# EAGLE design OledBoardV3 (EAGLE 9.5.0)
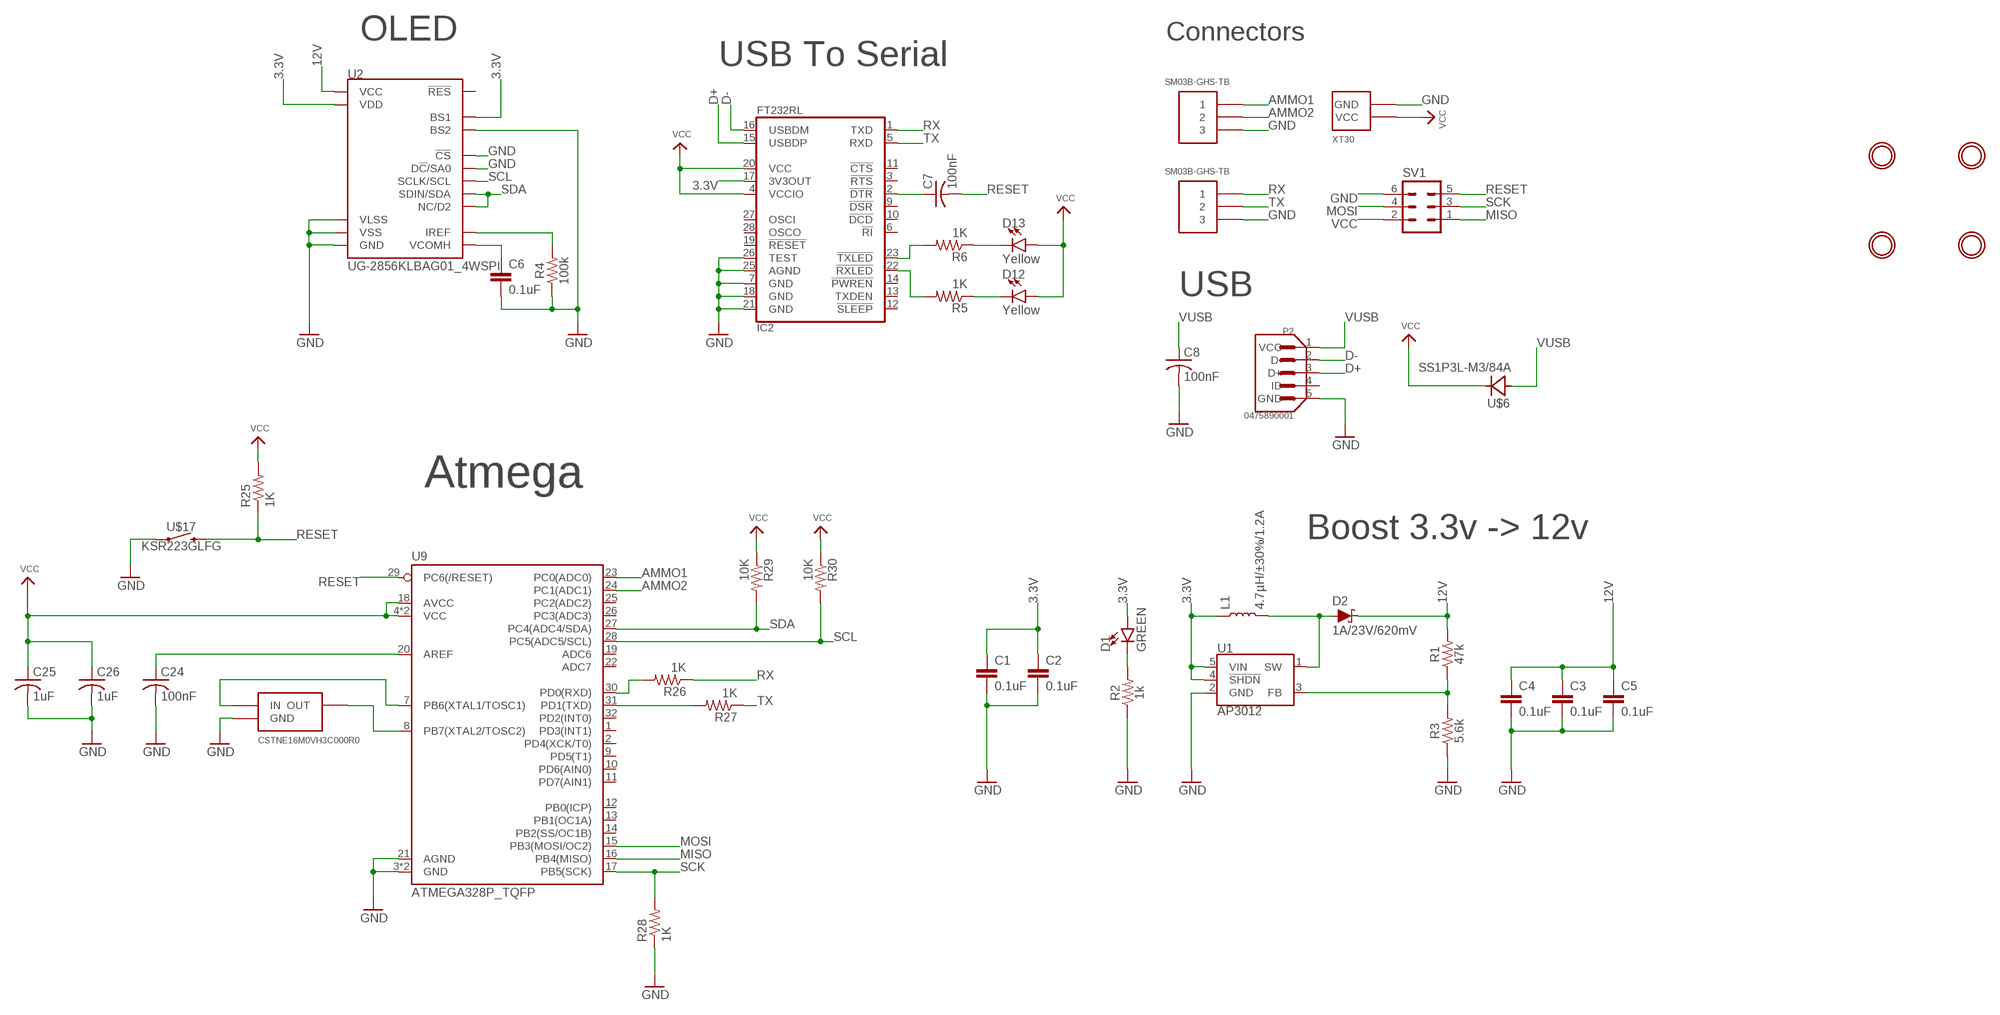
[diagram p0: schematic, sheet 1]

## Parts
C1  0.1uF  0.1UF-0603-25V-(+80/-20%)  [0603]
C2  0.1uF  0.1UF-0603-25V-(+80/-20%)  [0603]
C3  0.1uF  0.1UF-0603-25V-(+80/-20%)  [0603]
C4  0.1uF  0.1UF-0603-25V-(+80/-20%)  [0603]
C5  0.1uF  0.1UF-0603-25V-(+80/-20%)  [0603]
C6  0.1uF  0.1UF-0603-25V-(+80/-20%)  [0603]
C7  100nF  C-USC0603  [C0603]
C8  100nF  C-USC0603  [C0603]
C24  100nF  C-USC0603  [C0603]
C25  1uF  C-USC0603  [C0603]
C26  1uF  C-USC0603  [C0603]
D1  GREEN  LED0603  [LED-0603]
D2  1A/23V/620mV  DIODE-SCHOTTKY-BAT20J  [SOD-323]
D12  Yellow  LED0603  [LED-0603]
D13  Yellow  LED0603  [LED-0603]
IC2  FT232RL  [SSOP28-LD]
L1  4.7µH/±30%/1.2A  INDUCTOR-CDRH-4.7UH  [INDUCTOR_4.7UH]
P2  0475890001  [MOLEX_0475890001]
R1  47k  47KOHM-0603-1/10W-1%  [0603]
R2  1k  1KOHM-0603-1/10W-1%  [0603]
R3  5.6k  5.6KOHM-0603-1/10W-1%  [0603]
R4  100k  100KOHM-0603-1/10W-1%  [0603]
R5  1K  R-US_R0603  [R0603]
R6  1K  R-US_R0603  [R0603]
R25  1K  R-US_R0603  [R0603]
R26  1K  R-US_R0603  [R0603]
R27  1K  R-US_R0603  [R0603]
R28  1K  R-US_R0603  [R0603]
R29  10K  R-US_R0603  [R0603]
R30  10K  R-US_R0603  [R0603]
SV1  MA03-2  [MA03-2]
U1  AP3012  [SOT23-5]
U2  UG-2856KLBAG01_4WSPI  [FPC05024-42201]
U9  ATMEGA328P_TQFP  [TQFP32-08]
U$1  MOUNTINGHOLE2.5  [MOUNTINGHOLE_2.5_PLATED]
U$2  MOUNTINGHOLE2.5  [MOUNTINGHOLE_2.5_PLATED]
U$3  MOUNTINGHOLE2.5  [MOUNTINGHOLE_2.5_PLATED]
U$4  MOUNTINGHOLE2.5  [MOUNTINGHOLE_2.5_PLATED]
U$5  SM03B-GHS-TB  [SM03B-GHS-TB]
U$6  SS1P3L-M3/84A  [SS1P3L-M3/84A]
U$8  SM03B-GHS-TB  [SM03B-GHS-TB]
U$9  XT30PW-M  [XT30]
U$16  CSTNE16M0VH3C000R0  [CSTNE16M0VH3C000R0]
U$17  KSR223GLFG  [KSR223GLFG]

## Nets
3.3V: C1.1 C2.1 D1.A IC2.17(3V3OUT) L1.P$1 U1.4(!SHDN!) U1.5(VIN) U2.P$5(VDD) U2.P$6(BS1)
12V: C3.1 C4.1 C5.1 D2.C R1.2 U2.P$23(VCC)
AMMO1: U9.23(PC0(ADC0)) U$5.P$3
AMMO2: U9.24(PC1(ADC1)) U$5.P$4
D+: IC2.15(USBDP) P2.3(D+)
D-: IC2.16(USBDM) P2.2(D-)
GND: C1.2 C2.2 C3.2 C4.2 C5.2 C6.2 C8.2 C24.2 C25.2 C26.2 IC2.7(GND) IC2.18(GND) IC2.21(GND) IC2.25(AGND) IC2.26(TEST) P2.5(GND) R2.1 R3.1 R4.1 R28.1 SV1.6 U1.2(GND) U2.P$1(GND) U2.P$2(VLSS) U2.P$3(VSS) U2.P$7(BS2) U2.P$8(!CS) U2.P$10(D!C!/SA0) U2.P$11(GND) U2.P$12(GND) U2.P$16(GND) U2.P$17(GND) U2.P$18(GND) U2.P$19(GND) U2.P$20(GND) U2.P$24(GND) U9.3(GND) U9.5(GND) U9.21(AGND) U$5.P$5 U$8.P$5 U$9.P$2(GND) U$16.2(GND) U$17.P$1
MISO: SV1.1 U9.16(PB4(MISO))
MOSI: SV1.4 U9.15(PB3(MOSI/OC2))
N$1: D1.C R2.2
N$2: R1.1 R3.2 U1.3(FB)
N$3: C6.1 U2.P$22(VCOMH)
N$4: D2.A L1.P$2 U1.1(SW)
N$5: R4.2 U2.P$21(IREF)
N$6: C7.1 IC2.2(!DTR)
N$7: IC2.23(!TXLED) R6.2
N$8: IC2.22(!RXLED) R5.2
N$9: D13.C R6.1
N$10: D12.C R5.1
N$35: U9.7(PB6(XTAL1/TOSC1)) U$16.1(IN)
N$36: U9.8(PB7(XTAL2/TOSC2)) U$16.3(OUT)
N$37: C24.1 U9.20(AREF)
N$38: R27.2 U9.31(PD1(TXD))
N$40: R26.2 U9.30(PD0(RXD))
RESET: C7.2 R25.1 SV1.5 U9.29(PC6(/RESET)) U$17.P$2
RX: IC2.1(TXD) R26.1 U$8.P$3
SCK: R28.2 SV1.3 U9.17(PB5(SCK))
SCL: R30.2 U2.P$13(SCLK/SCL) U9.28(PC5(ADC5/SCL))
SDA: R29.2 U2.P$14(SDIN/SDA) U2.P$15(NC/D2) U9.27(PC4(ADC4/SDA))
TX: IC2.5(RXD) R27.1 U$8.P$4
VCC: C25.1 C26.1 D12.A D13.A IC2.4(VCCIO) IC2.20(VCC) R25.2 R29.1 R30.1 SV1.2 U9.4(VCC) U9.6(VCC) U9.18(AVCC) U$6.P$1(C) U$9.P$1(VCC)
VUSB: C8.1 P2.1(VCC) U$6.P$2(A)
Unconnected: IC2.3(!RTS) IC2.6(!RI) IC2.9(!DSR) IC2.10(!DCD) IC2.11(!CTS) IC2.12(!SLEEP) IC2.13(TXDEN) IC2.14(!PWREN) IC2.19(!RESET) IC2.27(OSCI) IC2.28(OSCO) P2.4(ID) U2.P$9(!RES) U9.1(PD3(INT1)) U9.2(PD4(XCK/T0)) U9.9(PD5(T1)) U9.10(PD6(AIN0)) U9.11(PD7(AIN1)) U9.12(PB0(ICP)) U9.13(PB1(OC1A)) U9.14(PB2(SS/OC1B)) U9.19(ADC6) U9.22(ADC7) U9.25(PC2(ADC2)) U9.26(PC3(ADC3)) U9.32(PD2(INT0))

## Notes on the sheet
- OLED | Connectors
- USB To Serial
- USB
- Atmega
- Boost 3.3v -> 12v

## Library data of the parts
C1-C6 = SparkFun-Capacitors:0.1UF: 0.1µF ceramic capacitors A capacitor is a passive two-terminal electrical component used to store electrical energy temporarily in an electric field.; PROD_ID: CAP-00810
C7 C8 C24-C26 = rcl:C-US: CAPACITOR, American symbol; SPICEPREFIX: C
D1 D12 D13 = SparkFun-LED:LED: LED (Generic) Standard schematic elements and footprints for 5mm, 3mm, 1206, and 0603 sized LEDs. Generic LEDs with no color specified.
D2 = SparkFun-DiscreteSemi:DIODE-SCHOTTKY: Schottky diode A Schottky diode is a semiconductor diode which has a low forward voltage drop and a very fast switching action.; PROD_ID: DIO-11623
IC2 = FT232RL:FT232RL; DESCRIPTION: USB Bridge, USB to UART USB 2.0 UART Interface 28-SSOP; DIGI-KEY_PART_NUMBER: 768-1007-1-ND; DIGI-KEY_PURCHASE_URL: https://www.digikey.com/product-detail/en/ftdi-future-technology-devices-international-ltd/FT232RL-REEL/768-1007-1-ND/1836402?utm_source=snapeda&utm_medium=aggregator&utm_campaign=symbol; MF: FTDI, Future; MP: FT232RL; PACKAGE: SSOP-28 FTDI, Future
L1 = SparkFun-Coils:INDUCTOR: Inductors Resist changes in electrical current. Basically a coil of wire. SparkFun Products: SparkFun Load Cell Amplifier - HX711 <https://www.sparkfun.com/products/13879> IOIO-OTG - V2.2 <https://www.sparkfun.com/products/13613>; PROD_ID: NDUC-10146
P2 = 0475890001:0475890001: Conn Micro USB Type AB RCP 5 POS 0.65mm Solder RA SMD 5 Terminal 1 Port T/R; DESCRIPTION: USB - micro AB Receptacle Connector 5 Position Surface Mount, Right Angle; Through Hole; DIGI-KEY_PART_NUMBER: WM17143CT-ND; DIGI-KEY_PURCHASE_URL: https://www.digikey.com/product-detail/en/molex/0475890001/WM17143CT-ND/1832255?utm_source=snapeda&utm_medium=aggregator&utm_campaign=symbol; MF: Molex; MP: 0475890001; PACKAGE: None
R1 = SparkFun-Resistors:47KOHM: 47kΩ resistor A resistor is a passive two-terminal electrical component that implements electrical resistance as a circuit element. Resistors act to reduce current flow, and, at the same time, act to lower voltage levels within circuits. - Wikipedia; PROD_ID: RES-07871
R2 = SparkFun-Resistors:1KOHM: 1kΩ resistor A resistor is a passive two-terminal electrical component that implements electrical resistance as a circuit element. Resistors act to reduce current flow, and, at the same time, act to lower voltage levels within circuits. - Wikipedia; PROD_ID: RES-07856
R3 = SparkFun-Resistors:5.6KOHM: 5.6kΩ resistor A resistor is a passive two-terminal electrical component that implements electrical resistance as a circuit element. Resistors act to reduce current flow, and, at the same time, act to lower voltage levels within circuits. - Wikipedia; PROD_ID: RES-12378
R4 = SparkFun-Resistors:100KOHM: 100kΩ resistor A resistor is a passive two-terminal electrical component that implements electrical resistance as a circuit element. Resistors act to reduce current flow, and, at the same time, act to lower voltage levels within circuits. - Wikipedia; PROD_ID: RES-07828
R5 R6 R25-R30 = rcl:R-US_: RESISTOR, American symbol; SPICEPREFIX: R
SV1 = con-lstb:MA03-2: PIN HEADER; OC_FARNELL: unknown; OC_NEWARK: unknown
U1 = SparkFun-IC-Power:AP3012: AP3012 The AP3012 is a high power, constant frequency, current mode PWM, inductor based, step-up (boost) converter. The converter operates at high frequency (1.5MHz) so that a small, low profile inductor can be used. Datasheet <https://www.diodes.com/assets/Datasheets/AP3012.pdf>; PROD_ID: VREG-13911
U2 = SparkFun-Displays:UG-2856KLBAG01_4WSPI; PROD_ID: CONN-14195
U9 = SparkFun-IC-Microcontroller:ATMEGA328P_TQFP: Popular 328P in QFP Storefront component: ATmega328 - TQFP <https://www.sparkfun.com/products/13448> (COM-13448) Datasheet <http://www.sparkfun.com/datasheets/Components/SMD/ATMega328.pdf> SparkFun Products SparkFun RedBoard - Programmed with Arduino <https://www.sparkfun.com/products/12757> (DEV-12757) Arduino Pro Mini 328 - 5V/16MHz <https://www.sparkfun.com/products/11113> (DEV-11113) Arduino Pro Mini 328 - 3.3V/8MHz <https://www.sparkfun.com/products/11114> (DEV-11114) SparkFun OpenLog <https://www.sparkfun.com/products/13712> (DEV-13712) SparkFun MicroView - OLED Arduino Module <https://www.sparkfun.com/products/12923> (DEV-12923) SparkFun Digital Sandbox <https://www.sparkfun.com/products/12651> (DEV-12651) SparkFun PicoBoard <https://www.sparkfun.com/products/11888> (WIG-11888) Arduino Fio <https://www.sparkfun.com/products/10116> (DEV-10116) LilyPad Arduino 328 Main Board <https://www.sparkfun.com/products/13342> (DEV-13342) SparkFun RedStick <https://www.sparkfun.com/products/13741> (DEV-13741) LilyPad MP3 <https://www.sparkfun.com/products/11013> (DEV-11013) LilyPad Arduino SimpleSnap <https://www.sparkfun.com/products/10941> (DEV-10941) SparkFun Stepoko <https://www.sparkfun.com/products/13899> (ROB-13899) SparkFun Geiger Counter <https://www.sparkfun.com/products/11345> (SEN-11345) SparkFun EL Sequencer <https://www.sparkfun.com/products/12781> (COM-12781) Arduino Pro 328 - 5V/16MHz <https://www.sparkfun.com/products/10915> (DEV-10915) CryptoCape <https://www.sparkfun.com/products/12773> (DEV-12773) SparkFun IR Thermometer Evaluation Board - MLX90614 <https://www.sparkfun.com/products/10740> (SEN-10740) SparkFun RedBot Mainboard <https://www.sparkfun.com/products/12097> (ROB-12097) Arduino Pro 328 - 3.3V/8MHz <https://www.sparkfun.com/products/10914> (DEV-10914) SparkFun Block for Intel® Edison - Arduino <https://www.sparkfun.com/products/13036> (DEV-13036) SparkFun Simon Says - Surface Mount Soldering Kit <https://www.sparkfun.com/products/10935> (KIT-10935) SparkFun 7-Segment Serial Display - Red <https://www.sparkfun.com/products/11441> (COM-11441) SparkFun 7-Segment Serial Display - White <https://www.sparkfun.com/products/11629> (COM-11629) SparkFun 7-Segment Serial Display - Yellow <https://www.sparkfun.com/products/11443> (COM-11443) SparkFun 7-Segment Serial Display - Kelly Green <https://www.sparkfun.com/products/11440> (COM-11440) SparkFun 7-Segment Serial Display - Blue <https://www.sparkfun.com/products/11442> (COM-11442) SparkFun OpenSegment Serial Display - 20mm (Blue) <https://www.sparkfun.com/products/11647> (COM-11647) SparkFun OpenSegment Serial Display - 20mm (Green) <https://www.sparkfun.com/products/11646> (COM-11646) SparkFun OpenSegment Serial Display - 20mm (White) <https://www.sparkfun.com/products/11648> (COM-11648) SparkFun OpenSegment Serial Display - 20mm (Red) <https://www.sparkfun.com/products/11644> (COM-11644) SparkFun OpenSegment Serial Display - 20mm (Yellow) <https://www.sparkfun.com/products/11645> (COM-11645) SparkFun OpenSegment Shield <https://www.sparkfun.com/products/13190> (DEV-13190); PROD_ID: IC-09069
U$1-U$4 = microbuilder:MOUNTINGHOLE: Mounting Hole For #2 screws (0.086"/2.18mm width, 0.094"/2.4mm hole) use 2.5mm
U$5 U$8 = oledBoard:SM03B-GHS-TB
U$6 = HenrySilva:SS1P3L-M3/84A
U$9 = oledBoard:XT30PW-M
U$16 = HenrySilva:CSTNE16M0VH3C000R0
U$17 = HenrySilva:KSR223GLFG

## Net classes
2 Power: width 0.203 mm, drill 0.203 mm, clearance 0.203 mm

## Board
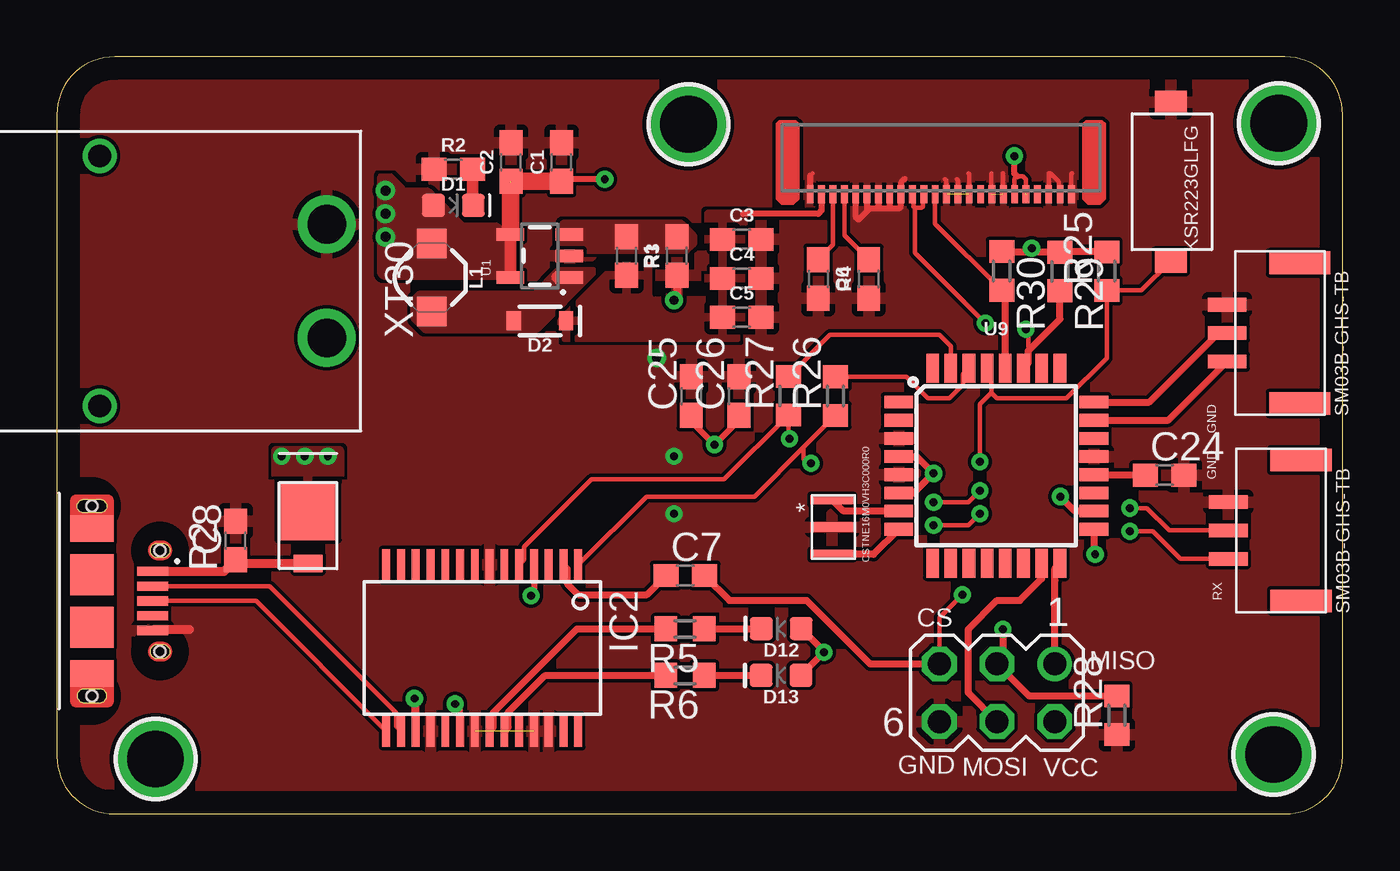
[diagram p1: board, top side]
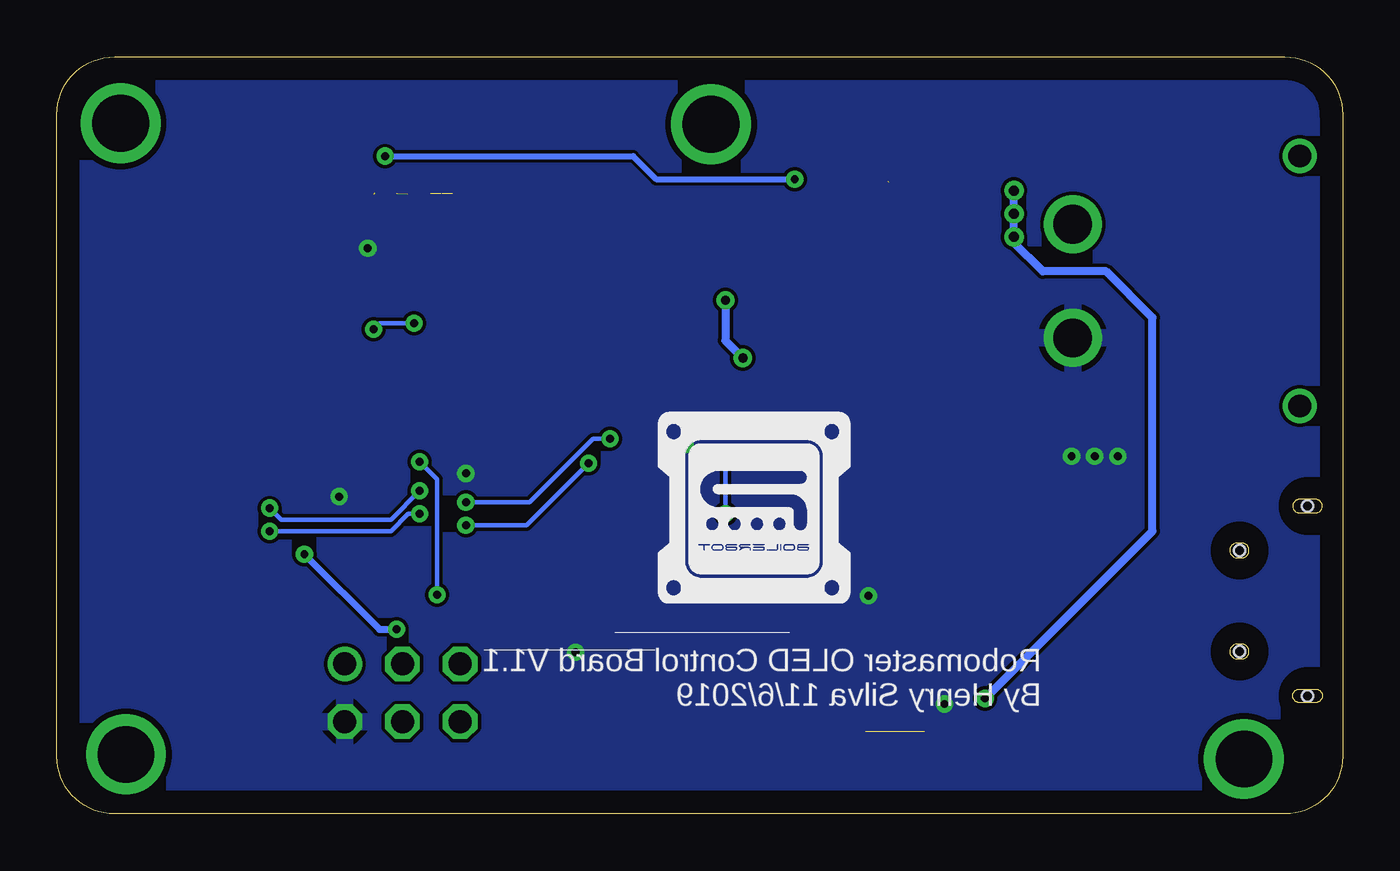
[diagram p2: board, bottom side, seen from below]

Size 56.62 x 33.33 mm. Coordinates in mm from the lower left corner, seen from the top.
Outline: 54.08,33.33 2.54,33.33 arc90 0,30.79 0,2.54 arc90 2.54,0 54.08,0 arc90 56.62,2.54 56.62,30.79 arc90 54.08,33.33
Copper layers (1*16): Top 0.035mm / dielectric 1.5mm / Bottom 0.035mm
Design rules "default *": minimum track width 6mil, minimum drill 0.35mm, track to track 6mil, track to pad 6mil, pad to pad 6mil, via to via 6mil, smd to smd 6mil, copper to edge 40mil, drill to drill 6mil, minimum pad ring 10mil, minimum via ring 8mil, stop-mask expansion 4mil, vias tented up to drill 23mil, thermal gap 10mil

### Footprints (pad centres in the part's own frame; a part is rotated, then mirrored left to right if it is on the bottom)
0603 = smd 1.1 x 1: 1 -0.85,0; 2 0.85,0
C0603 = smd 1.1 x 1: 1 -0.85,0; 2 0.85,0
LED-0603 = smd 1 x 1: A -0.877,0; C 0.877,0
SOD-323 = smd 0.63 x 0.83: A 1.15,0; C -1.15,0
SSOP28-LD = smd 0.348 x 1.397: 1 -4.225,-3.656; 2 -3.575,-3.656; 3 -2.925,-3.656; 4 -2.275,-3.656; 5 -1.625,-3.656; 6 -0.975,-3.656; 7 -0.325,-3.656; 8 0.325,-3.656; 9 0.975,-3.656; 10 1.625,-3.656; 11 2.275,-3.656; 12 2.925,-3.656; 13 3.575,-3.656; 14 4.225,-3.656; 15 4.225,3.656; 16 3.575,3.656; 17 2.925,3.656; 18 2.275,3.656; 19 1.625,3.656; 20 0.975,3.656; 21 0.325,3.656; 22 -0.325,3.656; 23 -0.975,3.656; 24 -1.625,3.656; 25 -2.275,3.656; 26 -2.925,3.656; 27 -3.575,3.656; 28 -4.225,3.656
INDUCTOR_4.7UH = smd 1.3 x 1.3: P$1 -1.5,0; P$2 1.5,0
MOLEX_0475890001 = smd 0.4 x 1.35: 1 -1.3,2.675; 2 -0.65,2.675; 3 0,2.675; 4 0.65,2.675; 5 1.3,2.675 | smd 1.175 x 1.9: 6 -3.187,0; 9 3.187,0 | smd 1.8 x 1.9: 7 -1.15,0; 8 1.15,0 | hole 0.5: -2.225,3; 2.225,3; -4.175,0; 4.175,0
R0603 = smd 1 x 1.1: 1 -0.85,0; 2 0.85,0
MA03-2 = drill 1.016: 1 -2.54,-1.27 | drill 1.016 octagon: 2 -2.54,1.27; 3 0,-1.27; 4 0,1.27; 5 2.54,-1.27; 6 2.54,1.27
SOT23-5 = smd 0.55 x 1.2: 1 -0.95,-1.3; 2 0,-1.3; 3 0.95,-1.3; 4 0.95,1.3; 5 -0.95,1.3
FPC05024-42201 = smd 0.3 x 0.8: P$1 -5.75,0.4; P$2 -5.25,0.4; P$3 -4.75,0.4; P$4 -4.25,0.4; P$5 -3.75,0.4; P$6 -3.25,0.4; P$7 -2.75,0.4; P$8 -2.25,0.4; P$9 -1.75,0.4; P$10 -1.25,0.4; P$11 -0.75,0.4; P$12 -0.25,0.4; P$13 0.25,0.4; P$14 0.75,0.4; P$15 1.25,0.4; P$16 1.75,0.4; P$17 2.25,0.4; P$18 2.75,0.4; P$19 3.25,0.4; P$20 3.75,0.4; P$21 4.25,0.4; P$22 4.75,0.4; P$23 5.25,0.4; P$24 5.75,0.4
TQFP32-08 = smd 1.27 x 0.559: 1 -4.293,2.8; 2 -4.293,2; 3 -4.293,1.2; 4 -4.293,0.4; 5 -4.293,-0.4; 6 -4.293,-1.2; 7 -4.293,-2; 8 -4.293,-2.8; 17 4.293,-2.8; 18 4.293,-2; 19 4.293,-1.2; 20 4.293,-0.4; 21 4.293,0.4; 22 4.293,1.2; 23 4.293,2; 24 4.293,2.8 | smd 0.559 x 1.27: 9 -2.8,-4.293; 10 -2,-4.293; 11 -1.2,-4.293; 12 -0.4,-4.293; 13 0.4,-4.293; 14 1.2,-4.293; 15 2,-4.293; 16 2.8,-4.293; 25 2.8,4.293; 26 2,4.293; 27 1.2,4.293; 28 0.4,4.293; 29 -0.4,4.293; 30 -1.2,4.293; 31 -2,4.293; 32 -2.8,4.293
MOUNTINGHOLE_2.5_PLATED = drill 2.5 pad 3.2: P$1 0,0
SM03B-GHS-TB = smd 1 x 2.7: P$1 0.5,1.35; P$2 6.7,1.35 | smd 0.6 x 1.7: P$3 2.35,4.55; P$4 3.6,4.55; P$5 4.85,4.55
SS1P3L-M3/84A = smd 2.54 x 2.667: P$1 1.27,1.27 | smd 0.762 x 1.27: P$2 3.574,1.275
XT30 = drill 1.7: P$1 0,0; P$2 5,0 | drill 1: P$3 -3,10; P$4 8,10
CSTNE16M0VH3C000R0 = smd 0.4 x 1.9: 1 2.6,1; 2 1.4,1; 3 0.2,1
KSR223GLFG = smd 1 x 1.4: P$1 0.5,0.7; P$2 7.5,0.7

### Placement (x,y rotation side)
C1  22.23,28.69 90 top
C2  20,28.69 90 top
C3  30.16,25.29 0 top
C4  30.16,23.57 0 top
C5  30.16,21.86 0 top
C6  33.53,23.55 270 top
C7  27.67,10.49 0 top
C8  7.87,12.03 90 top
C24  48.78,14.91 0 top
C25  27.94,18.39 90 top
C26  30.04,18.39 90 top
D1  17.46,26.78 0 top
D2  21.27,21.7 180 top
D12  31.9,8.15 180 top
D13  31.89,6.1 180 top
IC2  18.73,7.3 180 top
L1  16.51,23.61 270 top
P2  1.55,9.37 270 top
R1  25.08,24.56 270 top
R2  17.46,28.37 0 top
R3  27.3,24.56 90 top
R4  35.75,23.55 90 top
R5  27.66,8.14 180 top
R6  27.66,6.1 180 top
R25  46.23,23.89 90 top
R26  34.29,18.39 90 top
R27  32.21,18.4 90 top
R28  46.67,4.34 90 top
R29  44.17,23.88 270 top
R30  41.61,23.9 270 top
SV1  41.4,5.33 180 top
U1  21.27,24.56 90 top
U2  38.93,27.67 180 top
U9  41.36,15.33 0 top
U$1  27.81,30.35 0 top
U$2  4.35,2.42 0 top
U$3  53.58,2.62 0 top
U$4  53.81,30.4 0 top
U$5  56.08,17.56 90 top
U$6  9.79,14.59 270 top
U$8  56.13,8.88 90 top
U$9  11.89,20.95 90 top
U$16  35.14,11.23 90 top
U$17  48.35,31.83 270 top

### Tracks (layer width: path | path; a pad name or v marks a point on that pad's centre or on a via)
3.3V  (via drill 0.35, 0.45)  (2 unrouted)
  Top 0.203: 42.63,27.32 42.67,27.37 42.67,27.94 42.55,28.07 42.29,28.07 42.17,27.95 U2.P$6
  Top 0.254: 42.29,28.07 42.16,28.19 v42.16,28.96 | v24.13,27.94 22.33,27.94 C1.1
  Top 0.356: IC2.17 15.81,5.02 v15.75,5.08
  Top 0.508: U1.4 U1.5
  Top 0.762: C2.1 C1.1 | U1.4 19.97,27.81
  Bottom 0.254: v42.16,28.96 31.24,28.96 30.23,27.94 v24.13,27.94
  Bottom 0.356: v15.75,5.08 8.38,12.45 8.38,21.84 10.41,23.88 13.21,23.88 14.48,25.15 v14.48,25.4 v14.48,26.42 v14.48,27.43
  pour Top (no thermals): 14.48,27.94 14.48,23.88 19.3,23.88 19.81,24.38 19.81,25.15 19.3,25.65 17.78,25.65 16.26,27.18 14.99,27.18 14.99,27.43
12V
  Top 0.254: 30.23,26.42 33.53,26.42 33.67,26.56 U2.P$23 | 29.31,25.5 C3.1
  pour Top: 24.64,24.13 22.23,21.72 22.23,21.08 22.35,20.95 29.97,20.95 30.23,21.21 30.23,26.42 28.7,26.42 28.7,22.73 28.57,22.61 26.42,22.61 26.29,22.48 26.04,22.73 26.04,24.13
AMMO1
  Top 0.305: U9.23 48.95,17.33 U$5.P$3
AMMO2
  Top 0.305: U9.24 48.1,18.13 51.14,21.16 U$5.P$4
D+
  Top 0.203: P2.3 8.78,9.37 IC2.15
D-
  Top 0.203: IC2.16 14.94,3.87 14.94,4.45 9.36,10.02 P2.2
GND  (via drill 0.35, 0.4)  (4 unrouted)
  Top 0.203: U2.P$12 39.17,27.88 39.12,27.94 | U2.P$11 39.67,27.89 39.62,27.94 | U2.P$10 40.17,28.15 40.13,28.19 | U2.P$8 41.15,27.3 41.15,28.19 | U2.P$7 41.66,27.29 41.66,28.19 | U2.P$3 43.68,28.18 43.69,28.19 43.75,28.19 44.13,27.82 44.13,27.32 U2.P$2 | U2.P$1 44.68,28.16 44.7,28.19 | 33.17,28.1 33.27,28.19
  Top 0.254: U2.P$20 35.17,26.29 35.31,26.16 35.67,26.53 | U2.P$19 35.67,26.53 | 36.08,26.65 35.79,26.65 35.67,26.53 | U2.P$18 36.17,26.74 36.08,26.65 | U2.P$17 36.65,27.25 36.65,26.72 36.58,26.65 | 36.58,26.65 36.08,26.65 | 36.58,26.65 37.08,26.65 37.15,26.72 37.15,27.25 U2.P$16 37.2,27.3 37.2,27.83 37.33,27.95 | 39.15,27.3 U2.P$12 39.2,27.3 | 40.15,27.3 U2.P$10 40.2,27.3 | U2.P$3 43.65,27.3 | U2.P$2 44.15,27.3 | 39.65,27.3 U2.P$11 39.7,27.3 | 41.15,27.3 U2.P$8 | 41.65,27.3 U2.P$7 | U2.P$24 33.17,28.1
  Top 0.356: R3.1 27.3,22.73 v27.18,22.61
  Top 0.406: P2.5 4.28,8.13 5.84,8.13
  Bottom 0.203: v27.18,15.75 v27.18,13.21
  Bottom 0.356: v27.18,22.61 27.18,20.83 v26.42,20.07
  pour Top (rank 2): -2.41,0.64 57.28,0.64 57.28,34.29 -2.41,34.29
MISO
  Top 0.305: SV1.1 43.94,10.27 43.95,10.28 43.95,10.82 U9.16
MOSI
  Top 0.305: SV1.4 40.13,5.33 40.13,8.13 41.4,9.4 42.42,9.4 43.36,10.34 U9.15
N$1
  Top 0.508: D1.C 18.31,26.81 R2.2
N$2
  Top 0.508: 24.98,25.51 R1.1
  pour Top (no thermals): 22.35,25.91 27.43,25.91 27.94,25.4 27.94,25.15 27.69,24.89 22.61,24.89 22.35,25.15
N$3
  Top 0.203: C6.1 34.17,25.04 U2.P$22
N$4
  Top 0.508: L1.P$2 16.91,21.7 | 22.03,23.61 U1.1
  pour Top (no thermals): 16,22.86 21.08,22.86 22.1,23.88 23.62,23.88 21.08,21.34 16.26,21.34 15.75,21.84 15.75,22.61
N$5
  Top 0.203: R4.2 34.67,25.47 U2.P$21
N$6
  Top 0.305: IC2.2 22.48,10.79 22.48,10.13 22.96,9.65 25.98,9.65 C7.1
N$7
  Top 0.305: IC2.23 19.88,3.82 19.88,4.47 21.5,6.1 R6.2
N$8
  Top 0.305: IC2.22 19.23,3.82 19.23,4.47 22.9,8.14 R5.2
N$9
  Top 0.305: R6.1 D13.C
N$10
  Top 0.305: R5.1 D12.C
N$35
  Top 0.305: U9.7 34.8,13.33 34.64,13.33 U$16.1
N$36
  Top 0.305: U9.8 35.97,11.43 U$16.3
N$37
  Top 0.305: U9.20 47.91,14.93 C24.1
N$38
  Top 0.203: U9.31 39.36,20.57 39.37,20.57 38.86,21.08 34.04,21.08 R27.2
N$40
  Top 0.203: R26.2 37.4,19.24 38.35,18.29 39.3,18.29 39.9,18.88 39.9,19.36 U9.30
RESET  (via drill 0.35)
  Top 0.203: U$17.P$2 47.76,23.04 R25.1 46.23,20.07 44.45,18.29 41.4,18.29 41.15,18.54 | U9.29 41.15,19.44 41.15,18.54 | SV1.5 38.86,8.64 v39.88,9.65 | v40.64,15.49 40.64,18.03 41.15,18.54
  Top 0.305: C7.2 29.62,9.4 33.02,9.4 35.81,6.6 SV1.5
  Bottom 0.203: v39.88,9.65 39.88,14.73 v40.64,15.49
RX  (via drill 0.35)
  Top 0.203: IC2.1 25.97,13.97 30.72,13.97 32.89,16.14 | 32.89,16.14 R26.1 | U$8.P$3 49.48,11.23 48.26,12.45 v47.24,12.45 | v40.64,13.21 40.13,12.7 v38.61,12.7 | v33.21,15.43 33.09,15.43 32.89,15.63 32.89,16.14
  Bottom 0.203: v47.24,12.45 41.91,12.45 41.15,13.21 v40.64,13.21 | v38.61,12.7 35.94,12.7 v33.21,15.43
SCK  (via drill 0.35)
  Top 0.305: R28.2 42.81,5.19 SV1.3 41.66,6.86 v41.66,8.13 | U9.17 45.66,11.49 v45.72,11.43
  Bottom 0.305: v45.72,11.43 42.42,8.13 v41.66,8.13
SCL
  Top 0.203: R30.2 38.67,25.98 U2.P$13
  Top 0.305: U9.28 41.76,22.89 R30.2
SDA  (via drill 0.35)
  Top 0.203: 37.78,26.67 38.07,26.67 38.13,26.73 38.13,27.22 U2.P$14 | 37.78,26.67 37.72,26.73 37.72,27.22 U2.P$15 | v40.89,21.59 37.78,24.7 37.78,26.67 | v42.67,21.34 42.78,21.23 42.78,20.38
  Top 0.305: U9.27 42.78,19.84 42.78,20.38 44.17,21.77 R29.2
  Bottom 0.203: v40.89,21.59 42.42,21.59 v42.67,21.34
TX  (via drill 0.35)
  Top 0.203: IC2.5 20.58,11.18 20.58,11.76 23.55,14.73 29.39,14.73 R27.1 32.21,16.56 v32.26,16.51 | U$8.P$4 48.99,12.48 48.01,13.46 v47.24,13.46 | v40.64,14.22 40.13,13.72 v38.61,13.72
  Bottom 0.203: v47.24,13.46 46.74,12.95 41.91,12.95 v40.64,14.22 | v38.61,13.72 35.81,13.72 33.02,16.51 v32.26,16.51
VCC  (via drill 0.35)
  Top 0.254: C25.1 27.94,17.27 v28.96,16.26 30.04,17.34 C26.1 | IC2.4 21.01,9.73 v20.88,9.6 | IC2.20 17.76,4.62 v17.54,4.84
  Top 0.305: D12.A 33.78,7.15 v33.78,7.11 D13.A | U9.6 37.75,14.13 v38.61,14.99 37.87,15.73 U9.4 | R30.1 42.78,24.75 v42.93,24.89 43.09,24.73 R29.1 44.18,24.74 R25.2 | U9.18 44.84,13.33 v44.2,13.97
  other vias: 9.91,15.75 10.92,15.75 11.94,15.75
  pour Bottom: -1.78,1.27 57.91,1.27 57.91,34.29 -1.78,34.29
  pour Top: 9.65,14.48 9.65,16 12.45,16 12.45,14.48
VUSB
  Top 0.406: P2.1 7.37,10.67 C8.1 8.03,11.02 U$6.P$2

### Text on the board
tNames: GND | GND | RX | CS | MISO | GND | MOSI | VCC
bNames: Robomaster OLED Control Board V1.1 / By Henry Silva 11/6/2019
tDocu: Notes: / - Put decoupling capacitor behind atmega / - Possibly change the micro usb footprint